# Altium schematic sheet Bridge Pair 1.SchDoc: VNH5019 Pair 1
size B; DrawnBy: Adam Vadala-Roth; DocumentNumber: 5; Revision: 2.1a; SheetNumber: 5; SheetTotal: 5
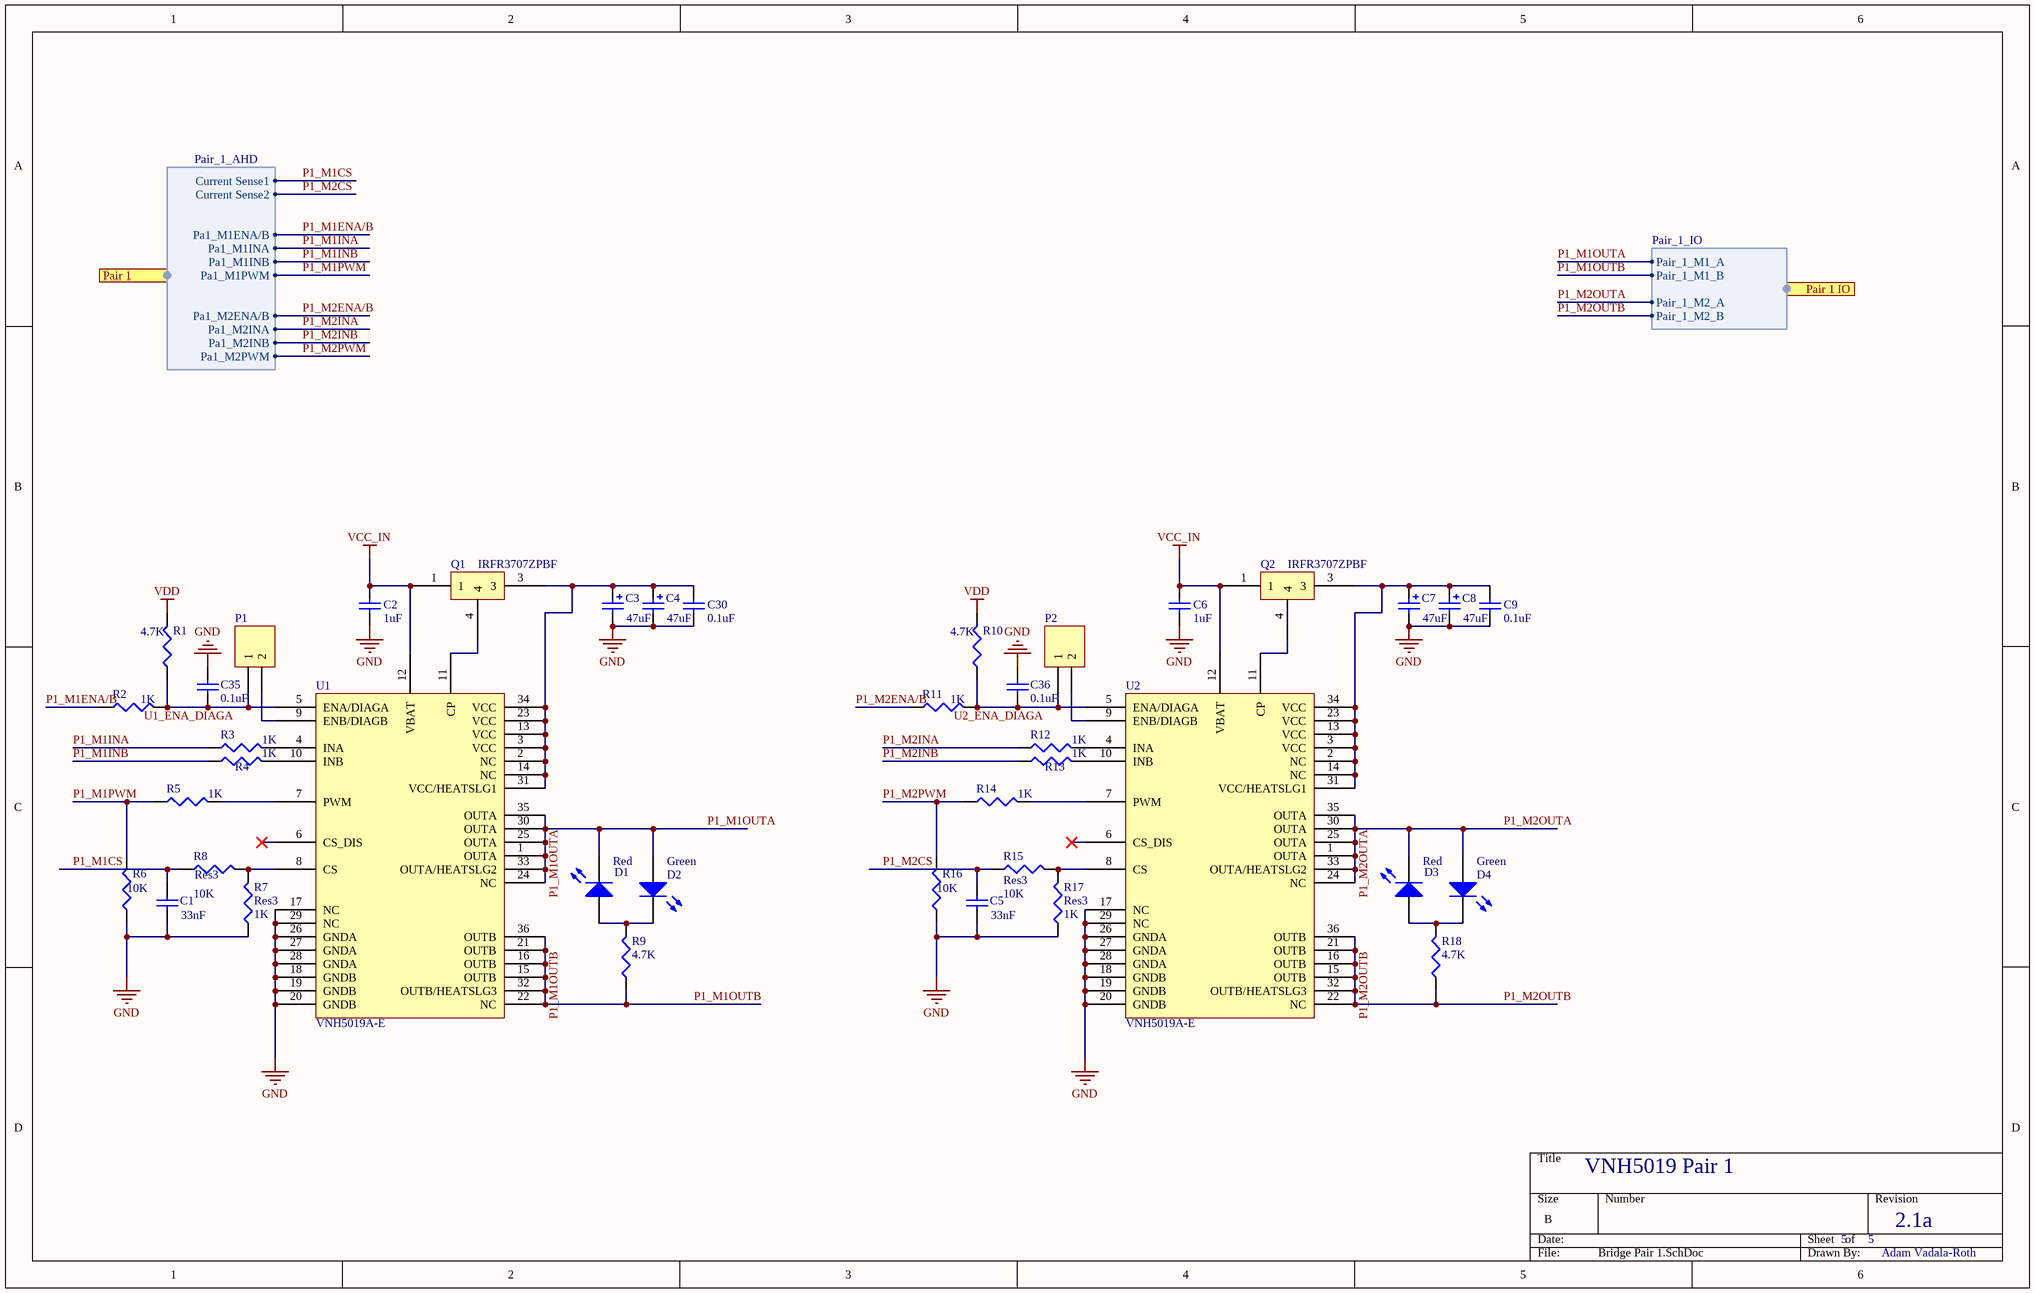
[diagram p0: Bridge Pair 1.SchDoc]

## Parts
C1  value 33nF  [1608[0603]]  (hidden comment: Cap Semi)
C2  value 1uF  [1608[0603]]  (hidden comment: Cap Semi)
C3  value 47uF  [CAPPR2-5x6.8]  (hidden comment: Cap Pol2)
C4  value 47uF  [CAPPR2-5x6.8]  (hidden comment: Cap Pol2)
C5  value 33nF  [1608[0603]]  (hidden comment: Cap Semi)
C6  value 1uF  [1608[0603]]  (hidden comment: Cap Semi)
C7  value 47uF  [CAPPR2-5x6.8]  (hidden comment: Cap Pol2)
C8  value 47uF  [CAPPR2-5x6.8]  (hidden comment: Cap Pol2)
C9  value 0.1uF  [C1206]  (hidden comment: Cap Semi)
C30  value 0.1uF  [C1206]  (hidden comment: Cap Semi)
C35  value 0.1uF  [1608[0603]]  (hidden comment: Cap Semi)
C36  value 0.1uF  [1608[0603]]  (hidden comment: Cap Semi)
D1  LED2  [3.2X1.6X1.1]  (value not drawn)
D2  LED2  [3.2X1.6X1.1]  (value not drawn)
D3  LED2  [3.2X1.6X1.1]  (value not drawn)
D4  LED2  [3.2X1.6X1.1]  (value not drawn)
P1  Header 2  [HDR1X2]  (value not drawn)
P2  Header 2  [HDR1X2]  (value not drawn)
Q1  IRFR3707ZPBF  [IRFR3707ZPBF]
Q2  IRFR3707ZPBF  [IRFR3707ZPBF]
R1  value 4.7K  [RESC1608L]  (hidden comment: Res3)
R2  value 1K  [RESC1608L]  (hidden comment: Res3)
R3  value 1K  [RESC1608L]  (hidden comment: Res3)
R4  value 1K  [RESC1608L]  (hidden comment: Res3)
R5  value 1K  [RESC1608L]  (hidden comment: Res3)
R6  value 10K  [RESC1608L]  (hidden comment: Res3)
R7  Res3  value 1K  [RESC1608L]
R8  Res3  value 10K  [RESC1608L]
R9  value 4.7K  [0805 SMD Resistor]  (hidden comment: Res3)
R10  value 4.7K  [RESC1608L]  (hidden comment: Res3)
R11  value 1K  [RESC1608L]  (hidden comment: Res3)
R12  value 1K  [RESC1608L]  (hidden comment: Res3)
R13  value 1K  [RESC1608L]  (hidden comment: Res3)
R14  value 1K  [RESC1608L]  (hidden comment: Res3)
R15  Res3  value 10K  [RESC1608L]
R16  value 10K  [RESC1608L]  (hidden comment: Res3)
R17  Res3  value 1K  [RESC1608L]
R18  value 4.7K  [0805 SMD Resistor]  (hidden comment: Res3)
U1  VNH5019A-E  [VNH5019A-E]
U2  VNH5019A-E  [VNH5019A-E]

## Ports
Pair 1 (harness Pair_1_AHD), Pair 1 IO (harness Pair_1_IO)

## Harnesses
Pair_1_IO: Pair_1_M1_A, Pair_1_M1_B, Pair_1_M2_A, Pair_1_M2_B
Pair_1_AHD: Current Sense1, Current Sense2, Pa1_M1ENA/B, Pa1_M1INA, Pa1_M1INB, Pa1_M1PWM, Pa1_M2INA, Pa1_M2ENA/B, Pa1_M2INB, Pa1_M2PWM

## Nets
GND: C1.1 C2.1 C3.2 C4.2 C5.1 C6.1 C7.2 C8.2 C9.1 C30.1 C35.1 C36.1 R6.1 R7.1 R16.1 R17.1 U1.17(NC) U1.18(GNDB) U1.19(GNDB) U1.20(GNDB) U1.26(GNDA) U1.27(GNDA) U1.28(GNDA) U1.29(NC) U2.17(NC) U2.18(GNDB) U2.19(GNDB) U2.20(GNDB) U2.26(GNDA) U2.27(GNDA) U2.28(GNDA) U2.29(NC)
VCC_IN: C2.2 C6.2 Q1.1 Q2.1 U1.12(VBAT) U2.12(VBAT)
VDD: R1.2 R10.2
P1_M1CS: C1.2 R8.1 ; port Pair 1.Current Sense1
P1_M1ENA/B: R2.1 ; port Pair 1.Pa1_M1ENA/B
P1_M1INA: R3.1 ; port Pair 1.Pa1_M1INA
P1_M1INB: R4.1 ; port Pair 1.Pa1_M1INB
P1_M1OUTA: D1.2(K) D2.1(A) U1.1(OUTA) U1.24(NC) U1.25(OUTA) U1.30(OUTA) U1.33(OUTA/HEATSLG2) U1.35(OUTA) ; port Pair 1 IO.Pair_1_M1_A
P1_M1OUTB: R9.1 U1.15(OUTB) U1.16(OUTB) U1.21(OUTB) U1.22(NC) U1.32(OUTB/HEATSLG3) U1.36(OUTB) ; port Pair 1 IO.Pair_1_M1_B
P1_M1PWM: R5.1 R6.2 ; port Pair 1.Pa1_M1PWM
P1_M2CS: C5.2 R15.1 ; port Pair 1.Current Sense2
P1_M2ENA/B: R11.1 ; port Pair 1.Pa1_M2ENA/B
P1_M2INA: R12.1 ; port Pair 1.Pa1_M2INA
P1_M2INB: R13.1 ; port Pair 1.Pa1_M2INB
P1_M2OUTA: D3.2(K) D4.1(A) U2.1(OUTA) U2.24(NC) U2.25(OUTA) U2.30(OUTA) U2.33(OUTA/HEATSLG2) U2.35(OUTA) ; port Pair 1 IO.Pair_1_M2_A
P1_M2OUTB: R18.1 U2.15(OUTB) U2.16(OUTB) U2.21(OUTB) U2.22(NC) U2.32(OUTB/HEATSLG3) U2.36(OUTB) ; port Pair 1 IO.Pair_1_M2_B
P1_M2PWM: R14.1 R16.2 ; port Pair 1.Pa1_M2PWM
U1_ENA_DIAGA: C35.2 P1.1 R1.1 R2.2 U1.5(ENA/DIAGA)
U2_ENA_DIAGA: C36.2 P2.1 R10.1 R11.2 U2.5(ENA/DIAGA)
NetC3_1: C3.1 C4.1 C30.2 Q1.3 U1.2(NC) U1.3(VCC) U1.13(VCC) U1.14(NC) U1.23(VCC) U1.31(VCC/HEATSLG1) U1.34(VCC)
NetC7_1: C7.1 C8.1 C9.2 Q2.3 U2.2(NC) U2.3(VCC) U2.13(VCC) U2.14(NC) U2.23(VCC) U2.31(VCC/HEATSLG1) U2.34(VCC)
NetD1_1: D1.1(A) D2.2(K) R9.2
NetD3_1: D3.1(A) D4.2(K) R18.2
NetP1_2: P1.2 U1.9(ENB/DIAGB)
NetP2_2: P2.2 U2.9(ENB/DIAGB)
NetQ1_4: Q1.4 U1.11(CP)
NetQ2_4: Q2.4 U2.11(CP)
NetR3_2: R3.2 U1.4(INA)
NetR4_2: R4.2 U1.10(INB)
NetR5_2: R5.2 U1.7(PWM)
NetR7_2: R7.2 R8.2 U1.8(CS)
NetR12_2: R12.2 U2.4(INA)
NetR13_2: R13.2 U2.10(INB)
NetR14_2: R14.2 U2.7(PWM)
NetR15_2: R15.2 R17.2 U2.8(CS)

Not connected (* = marked no-connect by the designer): U1 6(CS_DIS)*; U2 6(CS_DIS)*

## Notes on the sheet
- Red
- (near D2) Green
- (near D4) Green

## Library data of the parts
C1 C2 C5 C6 C9 C30 C35 C36 = Cap Semi: Capacitor (Semiconductor SIM Model); Published: 8-Jun-2000; LatestRevisionDate: 29-May-2009; LatestRevisionNote: IPC-7351 Footprint Added.; PackageReference: C1206; Publisher: Altium Limited; PackageDescription: Chip Capacitor
C3 C4 C7 C8 = Cap Pol2: Polarized Capacitor (Axial); Published: 8-Jun-2000; LatestRevisionDate: 17-Jul-2002; LatestRevisionNote: Re-released for DXP Platform.; PackageReference: POLAR0.8; Publisher: Altium Limited; PackageDescription: Polarized Capacitor; 2 Leads
D1-D4 = LED2: Typical RED, GREEN, YELLOW, AMBER GaAs LED; Published: 8-Jun-2000; LatestRevisionDate: 17-Jul-2002; LatestRevisionNote: Re-released for DXP Platform.; PackageVersion: Feb-2002; PackageReference: 3.2X1.6X1.1; Publisher: Altium Limited; PackageDescription: SM LED; 2 Flat Leads
P1 P2 = Header 2: Header, 2-Pin; LatestRevisionDate: 17-Jul-2002; LatestRevisionNote: Re-released for DXP Platform.; Publisher: Altium Limited
Q1 Q2 = IRFR3707ZPBF: Power FET
R1-R18 = Res3: Resistor; Published: 8-Jun-2000; LatestRevisionDate: 29-May-2009; LatestRevisionNote: IPC-7351 Footprint Added.; PackageReference: J1-0603; Publisher: Altium Limited; PackageDescription: Chip Resistor
U1 U2 = VNH5019A-E: VNH5019A-E H-Bridge